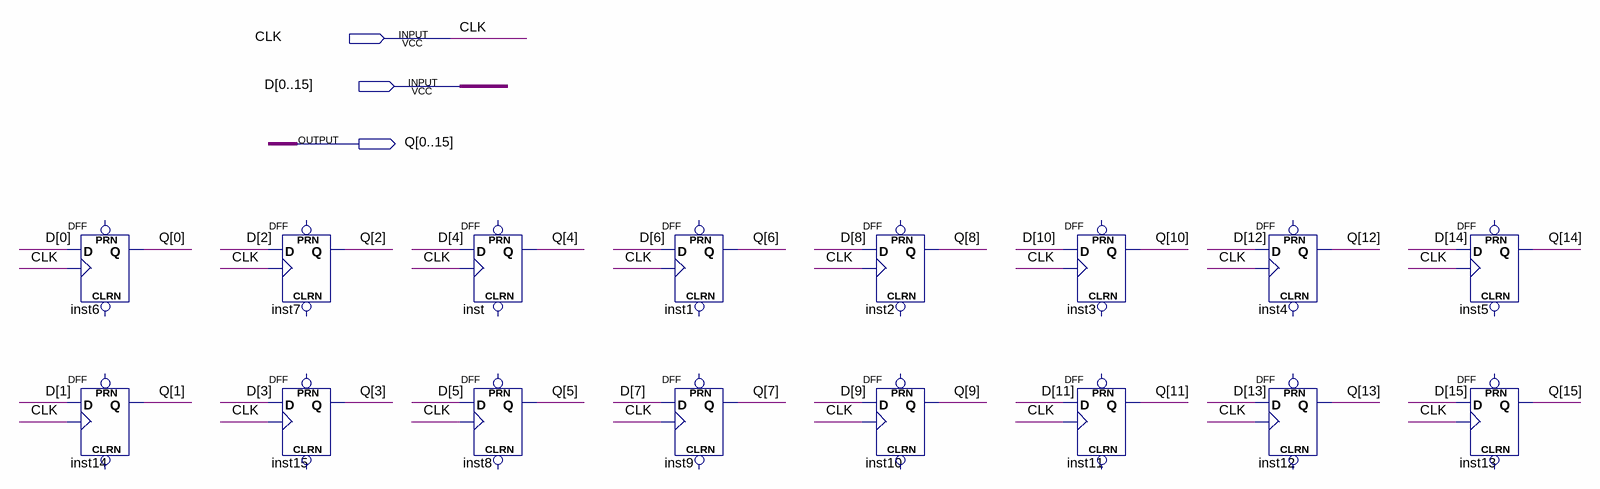
[diagram p0: schematic sheet]
// Quartus schematic clkinput.bdf as structural Verilog: 16 symbols, 3 pins
module clkinput (
  input  CLK,
  input  [0:15] D,
  output [0:15] Q
);

  DFF inst6 (.CLK(CLK), .D(D[0]), .Q(Q[0]));  // open: CLRN, PRN
  DFF inst14 (.CLK(CLK), .D(D[1]), .Q(Q[1]));  // open: CLRN, PRN
  DFF inst7 (.CLK(CLK), .D(D[2]), .Q(Q[2]));  // open: CLRN, PRN
  DFF inst15 (.CLK(CLK), .D(D[3]), .Q(Q[3]));  // open: CLRN, PRN
  DFF inst (.CLK(CLK), .D(D[4]), .Q(Q[4]));  // open: CLRN, PRN
  DFF inst8 (.CLK(CLK), .D(D[5]), .Q(Q[5]));  // open: CLRN, PRN
  DFF inst1 (.CLK(CLK), .D(D[6]), .Q(Q[6]));  // open: CLRN, PRN
  DFF inst9 (.CLK(CLK), .D(D[7]), .Q(Q[7]));  // open: CLRN, PRN
  DFF inst2 (.CLK(CLK), .D(D[8]), .Q(Q[8]));  // open: CLRN, PRN
  DFF inst10 (.CLK(CLK), .D(D[9]), .Q(Q[9]));  // open: CLRN, PRN
  DFF inst3 (.CLK(CLK), .D(D[10]), .Q(Q[10]));  // open: CLRN, PRN
  DFF inst11 (.CLK(CLK), .D(D[11]), .Q(Q[11]));  // open: CLRN, PRN
  DFF inst4 (.CLK(CLK), .D(D[12]), .Q(Q[12]));  // open: CLRN, PRN
  DFF inst12 (.CLK(CLK), .D(D[13]), .Q(Q[13]));  // open: CLRN, PRN
  DFF inst5 (.CLK(CLK), .D(D[14]), .Q(Q[14]));  // open: CLRN, PRN
  DFF inst13 (.CLK(CLK), .D(D[15]), .Q(Q[15]));  // open: CLRN, PRN
endmodule
